# EAGLE design EL3 (EAGLE 9.6.2)
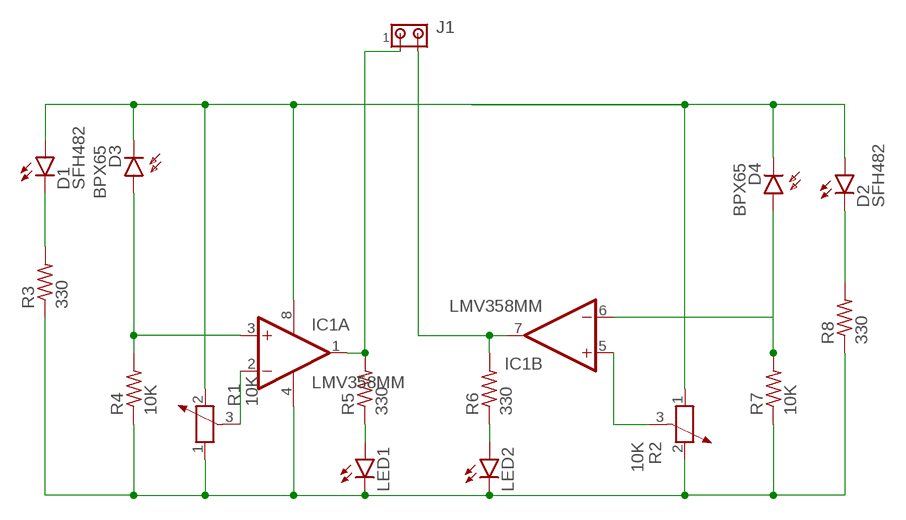
[diagram p0: schematic, sheet 1]

## Parts
D1  SFH482  [SFH482]
D2  SFH482  [SFH482]
D3  BPX65  [BPX65]
D4  BPX65  [BPX65]
IC1  LMV358MM  [MSOP08]
J1  MTA02-100  [10X02MTA]
LED1  LED3MM  [LED3MM]
LED2  LED3MM  [LED3MM]
R1  10K  POTENTIOMETER_PT-10  [PT-10]
R2  10K  POTENTIOMETER_PT-10  [PT-10]
R3  330  R-US_0204/5  [0204/5]
R4  10K  R-US_0204/5  [0204/5]
R5  330  R-US_0204/5  [0204/5]
R6  330  R-US_0204/5  [0204/5]
R7  10K  R-US_0204/5  [0204/5]
R8  330  R-US_0204/5  [0204/5]

## Nets
N$1: LED2.A R6.1
N$2: IC1.4(P:V-) LED1.K(C) LED2.K(C) R1.1 R2.2 R3.1 R4.1 R7.1 R8.1
N$3: D4.A IC1.6(B:-IN) R7.2
N$4: D2.K(C) R8.2
N$5: D1.A D2.A D3.K(C) D4.K(C) IC1.8(P:V+) R1.2 R2.1
N$6: IC1.5(B:+IN) R2.3
N$7: IC1.7(B:OUT) J1.2 R6.2
N$8: IC1.1(A:OUT) J1.1 R5.2
N$9: LED1.A R5.1
N$10: D1.K(C) R3.2
N$11: IC1.2(A:-IN) R1.3
N$12: D3.A IC1.3(A:+IN) R4.2

## Library data of the parts
D1 D2 = led:SFH482: IR LED infrared emitting diode, Infineon
D3 D4 = opto-trans-siemens:BPX65: PHOTO DIODE; MPN: BPX65.; OC_FARNELL: 327451; OC_NEWARK: 06WX2764
IC1 = linear:LMV358?*: Dual General Purpose, Low Voltage, Rail-to-Rail Output Operational Amplifiers Source: http://www.national.com/mpf/LM/LMV321.html http://www.national.com/dt/lmv_qual.pdf
J1 = con-amp:MTA02-100: AMP connector
LED1 LED2 = led:LED: LED OSRAM: - CHIPLED LG R971, LG N971, LY N971, LG Q971, LY Q971, LO R971, LY R971 LH N974, LH R974 LS Q976, LO Q976, LY Q976 LO Q996 - Hyper CHIPLED LW Q18S LB Q993, LB Q99A, LB R99A - SideLED LS A670, LO A670, LY A670, LG A670, LP A670 LB A673, LV A673, LT A673, LW A673 LH A674 LY A675 LS A676, LA A676, LO A676, LY A676, LW A676 LS A679, LY A679, LG A679 - Hyper Micro SIDELED® LS Y876, LA Y876, LO Y876, LY Y876 LT Y87S - SmartLED LW L88C, LW L88S LB L89C, LB L89S, LG L890 LS L89K, LO L89K, LY L89K LS L896, LA L896, LO L896, LY L896 - TOPLED LS T670, LO T670, LY T670, LG T670, LP T670 LSG T670, LSP T670, LSY T670, LOP T670, LYG T670 LG T671, LOG T671, LSG T671 LB T673, LV T673, LT T673, LW T673 LH T674 LS T676, LA T676, LO T676, LY T676, LB T676, LH T676, LSB T676, LW T676 LB T67C, LV T67C, LT T67C, LS T67K, LO T67K, LY T67K, LW E67C LS E67B, LA E67B, LO E67B, LY E67B, LB E67C, LV E67C, LT E67C LW T67C LS T679, LY T679, LG T679 LS T770, LO T770, LY T770, LG T770, LP T770 LB T773, LV T773, LT T773, LW T773 LH T774 LS E675, LA E675, LY E675, LS T675 LS T776, LA T776, LO T776, LY T776, LB T776 LHGB T686 LT T68C, LB T68C - Hyper Mini TOPLED® LB M676 - Mini TOPLED Santana® LG M470 LS M47K, LO M47K, LY M47K Source: http://www.osram.convergy.de LUXEON: - LUMILED® LXK2-PW12-R00, LXK2-PW12-S00, LXK2-PW14-U00, LXK2-PW14-V00 LXK2-PM12-R00, LXK2-PM12-S00, LXK2-PM14-U00 LXK2-PE12-Q00, LXK2-PE12-R00, LXK2-PE12-S00, LXK2-PE14-T00, LXK2-PE14-U00 LXK2-PB12-K00, LXK2-PB12-L00, LXK2-PB12-M00, LXK2-PB14-N00, LXK2-PB14-P00, LXK2-PB14-Q00 LXK2-PR12-L00, LXK2-PR12-M00, LXK2-PR14-Q00, LXK2-PR14-R00 LXK2-PD12-Q00, LXK2-PD12-R00, LXK2-PD12-S00 LXK2-PH12-R00, LXK2-PH12-S00 LXK2-PL12-P00, LXK2-PL12-Q00, LXK2-PL12-R00 Source: www.luxeon.com KINGBRIGHT: KA-3528ASYC Source: www.kingbright.com
R1 R2 = rcl:POTENTIOMETER_: Potentiometer; SPICEMODEL: POT; SPICEPREFIX: X
R3-R8 = rcl:R-US_: RESISTOR, American symbol; SPICEPREFIX: R

## Board
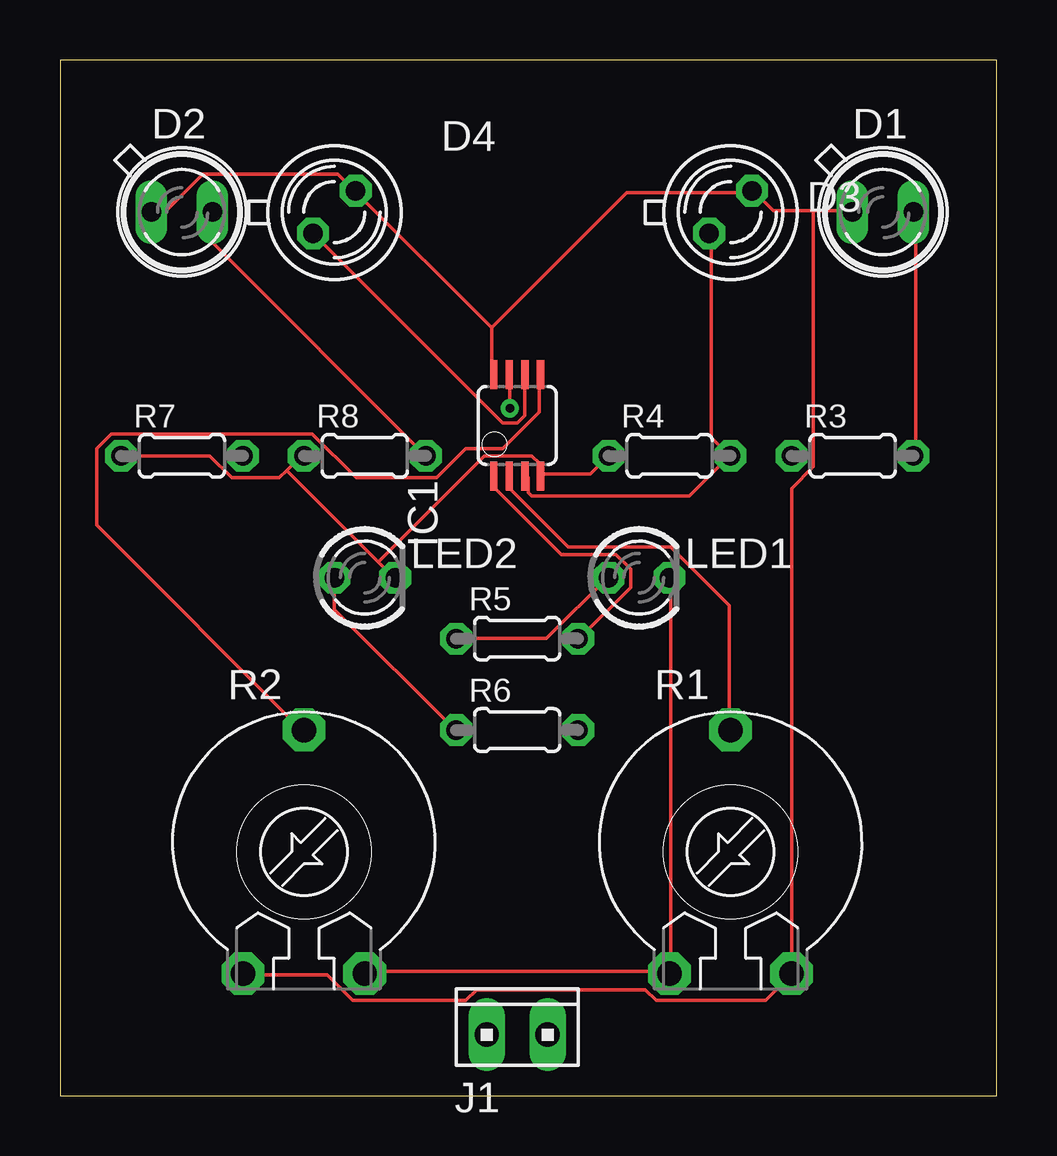
[diagram p1: board, top side]
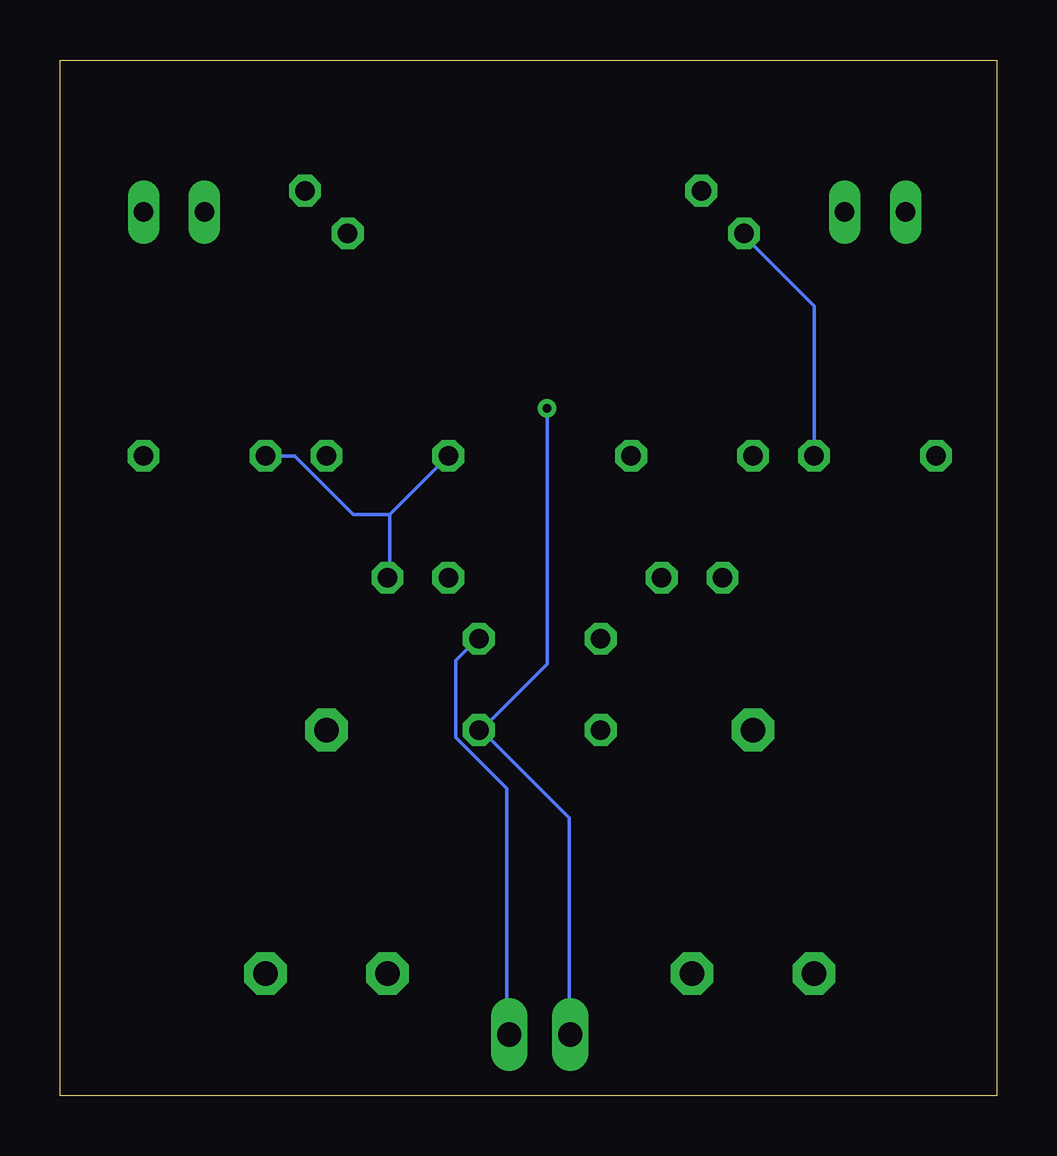
[diagram p2: board, bottom side, seen from below]

Size 39.04 x 43.17 mm. Coordinates in mm from the lower left corner, seen from the top.
Outline: 0,0 39.04,0 39.04,43.17 0,43.17 0,0
Copper layers (1*16): Top 0.035mm / dielectric 1.5mm / Bottom 0.035mm
Design rules "default": minimum track width 6mil, minimum drill 0.35mm, track to track 6mil, track to pad 6mil, pad to pad 6mil, via to via 6mil, smd to smd 6mil, copper to edge 40mil, drill to drill 6mil, minimum pad ring 10mil, minimum via ring 8mil, stop-mask expansion 4mil, vias tented up to drill 0mil, thermal gap 10mil

### Footprints (pad centres in the part's own frame; a part is rotated, then mirrored left to right if it is on the bottom)
SFH482 = drill 0.813 long: A -1.27,0; K 1.27,0
BPX65 = drill 0.813 octagon: A -0.889,-0.889; K 0.889,0.889
MSOP08 = smd 0.3 x 1.2: 1 -0.976,-2.113; 2 -0.326,-2.113; 3 0.324,-2.113; 4 0.974,-2.113; 5 0.974,2.112; 6 0.324,2.112; 7 -0.326,2.112; 8 -0.976,2.112
10X02MTA = drill 1.016 long: 1 1.27,0; 2 -1.27,0
LED3MM = drill 0.813 octagon: A -1.27,0; K 1.27,0
PT-10 = drill 1.016 pad 1.778 octagon: 1 -2.54,-5.08; 2 2.54,-5.08; 3 0,5.08
0204/5 = drill 0.813 octagon: 1 -2.54,0; 2 2.54,0

### Placement (x,y rotation side)
D1  34.29,36.83 0 top
D2  5.08,36.83 0 top
D3  27.94,36.83 0 top
D4  11.43,36.83 0 top
IC1  19.05,27.94 0 top
J1  19.05,2.54 0 top
LED1  24.13,21.59 0 top
LED2  12.7,21.59 0 top
R1  27.94,10.16 0 top
R2  10.16,10.16 0 top
R3  33.02,26.67 0 top
R4  25.4,26.67 0 top
R5  19.05,19.05 0 top
R6  19.05,15.24 0 top
R7  5.08,26.67 0 top
R8  12.7,26.67 0 top

### Tracks (layer width: path | path; a pad name or v marks a point on that pad's centre or on a via)
N$1
  Top 0.152: LED2.A 11.43,20.27 16.46,15.24 R6.1
N$2
  Top 0.152: R2.2 12.8,5.18 25.3,5.18 R1.1 25.45,5.18 25.45,21.49 LED1.K | R4.1 22.1,25.91 20.12,25.91 IC1.4 19.96,25.91 19.96,26.36 19.66,26.67 17.68,26.67 13.26,22.25 | R7.1 6.25,26.67 7.16,25.76 9.14,25.76 9.45,26.06 | 9.45,26.06 10.06,26.67 R8.1 | 9.45,26.06 13.26,22.25 | 13.26,22.25 13.87,21.64 LED2.K
  Bottom 0.152: 25.3,24.23 25.3,21.64 LED1.K | R4.1 25.3,24.23 | R3.1 29.26,26.67 26.82,24.23 25.3,24.23
N$3
  Top 0.152: D4.A 18.44,28.04 19.05,28.04 19.35,28.35 19.35,30.02 IC1.6
  Bottom 0.152: R7.2 7.62,32.92 10.52,35.81 D4.A
N$4
  Top 0.152: R8.2 6.4,35.51 6.4,36.73 D2.K
N$5
  Top 0.152: R2.1 7.62,5.03 11.12,5.03 12.19,3.96 16.92,3.96 17.37,4.42 24.38,4.42 24.84,3.96 29.41,3.96 30.48,5.03 R1.2 30.48,25.3 31.39,26.21 31.39,36.88 | 31.39,36.88 29.72,36.88 28.96,37.64 D3.K 28.8,37.64 23.62,37.64 17.98,32 | 31.39,36.88 32.92,36.88 D1.A | 17.98,32 17.98,30.18 IC1.8 | 17.98,32 12.34,37.64 D4.K 12.19,37.8 11.58,38.41 5.94,38.41 4.42,36.88 3.81,36.88 D2.A
N$6
  Top 0.152: IC1.5 19.96,30.02 19.96,28.5 18.44,26.98 16.92,26.98 15.7,25.76 12.34,25.76 10.52,27.58 2.13,27.58 1.52,26.98 1.52,23.77 10.06,15.24 R2.3
N$7  (via drill 0.35)
  Top 0.152: v18.74,28.65 18.74,30.02 IC1.7
  Bottom 0.152: v18.74,28.65 18.74,17.98 21.49,15.24 | 21.49,15.24 17.83,11.58 17.83,2.59 J1.2 | 21.49,15.24 R6.2
N$8
  Top 0.152: IC1.1 18.14,25.76 18.14,25.3 20.88,22.55 23.16,22.55 23.77,21.95 23.77,21.18 21.64,19.05 R5.2
  Bottom 0.152: J1.1 20.42,2.59 20.42,12.8 22.55,14.94 22.55,18.14 21.64,19.05 R5.2
N$9
  Top 0.152: R5.1 20.27,19.05 22.86,21.64 LED1.A
N$10
  Top 0.152: R3.2 35.66,26.67 35.66,36.73 D1.K
N$11
  Top 0.152: IC1.2 18.74,25.76 18.74,25.3 21.18,22.86 25.45,22.86 27.89,20.42 27.89,15.24 R1.3
N$12
  Top 0.152: 27.89,26.67 26.21,24.99 19.66,24.99 19.51,25.15 19.51,25.76 IC1.3 | 27.89,26.67 27.13,27.43 27.13,35.81 D3.A | 27.89,26.67 R4.2